# Altium schematic sheet USB_OTG.SchDoc
size A4; SheetNumber: 10; SheetTotal: 10
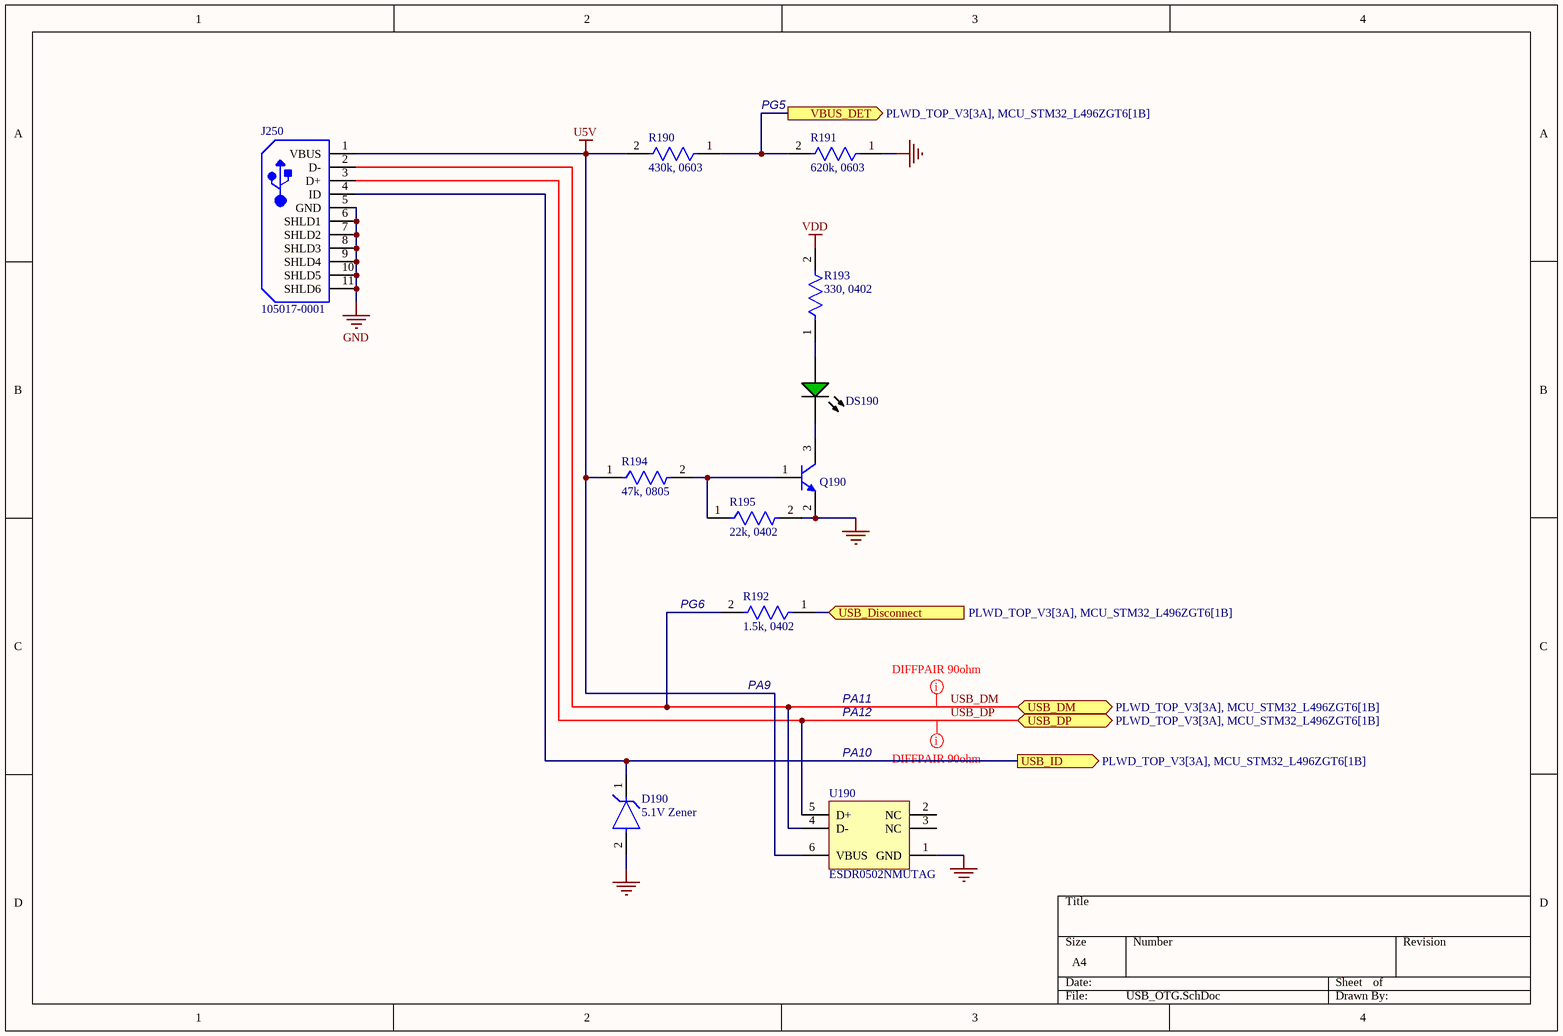
[diagram p0: USB_OTG.SchDoc]

## Parts
D190  5.1V Zener  [FP-SOD123-MFG]
DS190  LTST-C190GKT  [LTST-C190GKT_V]  (value not drawn)
J250  105017-0001  [USB-MICRO-B_V]
Q190  SBC817-40LT3G  [ONSC-SOT-23-3-318-08_V]  (value not drawn)
R190  430k, 0603  [FP-ESR03-IPC_C]
R191  620k, 0603  [FP-CRCW0603-e3-MFG]
R192  1.5k, 0402  [FP-RT0402-MFG]
R193  330, 0402  [FP-RG1005-MFG]
R194  47k, 0805  [FP-CRCW0805-HPe3-IPC_A]
R195  22k, 0402  [FP-RT0402-MFG]
U190  ESDR0502NMUTAG  [ONSC-UDFN-6-517AA-01_V]

## Ports
USB_Disconnect (in, see PLWD_TOP_V3[3A], MCU_STM32_L496ZGT6[1B]), USB_DM (bidir, see PLWD_TOP_V3[3A], MCU_STM32_L496ZGT6[1B]), USB_DP (bidir, see PLWD_TOP_V3[3A], MCU_STM32_L496ZGT6[1B]), USB_ID (out, see PLWD_TOP_V3[3A], MCU_STM32_L496ZGT6[1B]), VBUS_DET (out, see PLWD_TOP_V3[3A], MCU_STM32_L496ZGT6[1B])

## Nets
GND: D190.2(A) J250.5(GND) J250.6(SHLD1) J250.7(SHLD2) J250.8(SHLD3) J250.9(SHLD4) J250.10(SHLD5) J250.11(SHLD6) Q190.2(E) R191.1 R195.2 U190.1(GND)
U5V: J250.1(VBUS) R190.2 R194.1 U190.6(VBUS)
VDD: R193.2
USB_Disconnect: R192.1 ; port USB_Disconnect
USB_DM: J250.2(D-) R192.2 U190.4(D-) ; port USB_DM
USB_DP: J250.3(D+) U190.5(D+) ; port USB_DP
USB_ID: D190.1(C) J250.4(ID) ; port USB_ID
VBUS_DET: R190.1 R191.2 ; port VBUS_DET
NetDS190_1: DS190.1(A) R193.1
NetDS190_2: DS190.2(K) Q190.3(C)
NetQ190_1: Q190.1(B) R194.2 R195.1

Not connected (* = marked no-connect by the designer): U190 2(NC) 3(NC)

## Layout directives
mark named DIFFPAIR 90ohm: USB_DM, USB_DP

## Notes on the sheet
- PG5
- (near R192) PG6
- PA9
- PA12
- PA11
- PA10

## Library data of the parts
D190 = CMP-2000-05976-2: DIODE ZENER 5.1V 500MW SOD123; Manufacturer Part Number: BZT52C5V1-7-F; Manufacturer: Diodes Incorporated; Standoff Height: 0mm; Max Reverse Leakage Current: 2uA; Forward Current: 10mA; Power Dissipation: 370mW; Max Zener Voltage: 5.4V; Zener Impedance: 60Ω; Automotive Grade: NA; Max Junction Temp: +150°C; Device Class L3: Zener Diodes; ComponentLink2Description: Datasheet; Mouser Description: Zener Diodes 5.1V 500mW; Octopart: https://octopart.com/bzt52c5v1-7-f-diodes+inc.-326718; Package: SOD123; RoHS: TRUE; Nom Zener Voltage: 5.1V; Device Class L1: Discrete Semiconductors; Lead Free: Yes; Footprint Url: https://www.diodes.com/assets/Package-Files/SOD123.pdf; ComponentLink2URL: https://www.diodes.com/assets/Datasheets/ds18004.pdf; Digikey Description: DIODE ZENER 5.1V 500MW SOD123; Height: 1.45mm; Temperature Range Low: -65°C; Device Class L2: Diodes; Temperature: -65°C to +150°C; Automotive: No; Temperature Range High: +150°C; Category: Diode
DS190 = CMP-007-00022-2: LED Uni-Color Green, 100 mW, 30 mA, -55 to 85 degC, 2-Pin SMD, RoHS, Tape and Reel; Manufacturer: Lite-On; Power: 100mW; Forward Voltage: 2.1V; Viewing Angle: 130degrees; Forward Current: 20mA; Luminous Intensity: 6mcd; Lens Style: Clear; Manufacturer URL: http://www.us.liteon.com/; RoHS Compliant: True; Colour: Green; Package Description: 2-Pin Surface Mount Device, Body 1.6 x 0.8 mm; Datasheet URL: http://datasheet.octopart.com/LTST-C190GKT-Lite-On-datasheet-158530.pdf; Datasheet Version: Dec-06; Mounting Technology: SM; Case/Package: 0603; Package Reference: C190GKT; Packaging: TapeandReel; Min Operating Temperature: -55°C; Nominal Vf: 2.1V; Package Quantity: 3000; Illumination Colour: Green; Max Operating Temperature: 85°C; Pins: 2
J250 = CMP-2000-05827-1: Micro-USB B Receptacle, Right Angle, Bottom Mount, Surface Mount, with Solder Tabs, -30 to 85 degC, 5-Pin USB, RoHS, Tape and Reel; Manufacturer: Molex; Featured Product: Micro-USBConnectorsUSBConnectors; Other Names: WM1399DKR; Package Version: Rev. F, 12/2012; Number of Contacts: 5; Connector Type: USB-microB; Catalog Drawings: 1050170001; 3D Model: 105017-0001.stp; Mating Products: WM17145-ND-CABLEMICROUSBBTOSTDA1.0MWM17147-ND-CABLEMICROUSBBTOSTDA2.0MWM17146-ND-CABLEMICROUSBBTOSTDA1.5M; PCN Assembly/Origin: ResinSupplier21/Oct/2015; Voltage - Max: 30V; Online Catalog: Molex-MicroUSB; Manufacturer URL: http://www.molex.com/; Package Description: 5-Leads USB, Micro B, Body 7.5 x 5 mm, Pitch 0.65 mm; Datasheet URL: http://www.molex.com/elqNow/elqRedir.htm?ref=http://www.molex.com/webdocs/datasheets/pdf/en-us/1050170001_IO_CONNECTORS.pdf; Ingress Protection: -; Datasheet Version: 03/2016; Mounting Type: BoardCutout,SurfaceMount,RightAngle; Circuits: 5; Standard Package: 1; Package Reference: MICRO-B; Package URL: http://www.molex.com/pdm_docs/sd/1050170001_sd.pdf; Category: Connectors,Interconnects; Series: -; RoHS Information: 1050170001CertofCompliance; Features: Shielded,SolderRetention; Family: USB,DVI,HDMIConnectors; Specifications: -; Gender: Receptacle; Packaging: Digi-Reel®; Mounting Technology: SurfaceMount
Q190 = CMP-1048-00776-1: General Purpose Transistor, NPN Silicon, 3-Pin SOT-23, Pb-Free, Tape and Reel; Manufacturer: On Semiconductor; fT Min (MHz): 100; IC Continuous (A): 0.5; ComponentLink2URL: http://www.onsemi.com/pub_link/Collateral/BC817-16LT1-D.PDF; ComponentLink1Description: Manufacturer URL; Polarity: NPN; PackageDescription: 3-Pin Small Outline Transistor, Body 2.92 x 1.3 mm, Pitch 0.95 mm; ComponentLink2Description: Datasheet; PackageVersion: Rev. AP, 11/2009; Packing: Tape and Reel; RoHS: TRUE; ComponentLink3URL: http://www.onsemi.cn/pub_link/Collateral/318-08.PDF; PartNumber: SBC817-40LT3G; PackageReference: SOT-23-3-318-08; ComponentLink1URL: http://www.onsemi.com/; ComponentLink3Description: Package Specification; Mounting Technology: Surface Mount; DatasheetVersion: Rev. 12
R190 = CMP-08839-027977-1: 430kΩ ±5% 0.25W 0603 Anti-Surge Chip Resistor AEC-Q200; Temperature Coefficient: 200ppm/°C; Resistance: 430kR; Max Power Dissipation: 250mW; Length: 0.063inch; Case/Package: 0603; Number of Terminations: 2; Package Quantity: 5000; Series: ESR; Width: 0.031inch; Case Code (Imperial): 0603; Tolerance: 5%; Height: 0.022inch; Resistor Type: Thick Film; Packaging: Cut Tape; Min Operating Temperature: -55°C; Case Code (Metric): 1608; RoHS Compliant: Yes; Max Operating Temperature: 155°C; Features: Automotive AEC-Q200
R191 = CMP-2000-03512-2: RES Thick Film, 620kΩ, 5%, 0.1W, 200ppm/°C, 0603; Voltage Rating: 75V; Power Rating: 100mW; Resistance: 620kR; Tolerance: 5%; Military Standard: Not; Radiation Hardening: No; Lead Free: Lead Free; Contact Plating: Tin; Weight: 7.1E-05oz; Max Operating Temperature: 155°C; Case Code (Imperial): 0603; Voltage Rating (DC): 75V; Composition: Thick Film; Temperature Coefficient: 200ppm/°C; Height: 0.02inch; Min Operating Temperature: -55°C; Features: Automotive AEC-Q200; Width: 0.033inch; Max Power Dissipation: 100mW; Package Quantity: 1; Depth: 0.85mm; Length: 1.55mm; Packaging: Tape and Reel; Number of Terminations: 2; Case Code (Metric): 1608; Case/Package: 0603
R192 = CMP-03412-012409-1: RT0402DRE071K5L     RES SMD 1.5K OHM 0.5% 1/16W 0402; Manufacturer: Yageo; Power Rating: 0.063W; Temperature Coefficient: 50 ppm/°C; Resistance: 1.5KΩ; Voltage Rating: 50V; Value: 1.5KΩ; Tolerance: 0.005; Automotive: No; Composition: Thin Film; Device Class L2: Resistors; Footprint Url: http://www.yageo.com/exep/pages/download/literatures/PYu-R_Mount_10.pdf; Category: Res; RoHS: TRUE; Digikey Description: RES SMD 1.5K OHM 0.5% 1/16W 0402; Temperature Range Low: -55°C; Octopart: https://octopart.com/rt0402dre071k5l-yageo-1450177; Temperature Range High: +155°C; Device Class L3: Chip SMD Resistors; Temperature: -55°C to +155°C; Manufacturer Part Number: RT0402DRE071K5L; Ipc Land Pattern Name: RESC10050X30; Lead Free: Yes; Device Class L1: Passive Components; Series: RT; Height: 0.35mm; ComponentLink2Description: Datasheet; ComponentLink2URL: http://www.yageo.com/documents/recent/PYu-RT_1-to-0.01_RoHS_L_9.pdf; Package: RT0402
R193 = CMP-28537-007483-1: RG1005P-331-B-T5 / Automotive Metal Thin Film Chip Resistor, 0402, 330Ω, 0.1%, 25ppm/°C, 0.0625W, 75V; Power Rating: 63mW; Voltage Rating (DC): 25V; Resistance: 330R; Lead Free: Lead Free; Case Code (Metric): 1005; Width: 0.02inch; Tolerance: 0.1%; Max Power Dissipation: 63mW; Number of Terminations: 2; Resistor Type: Thin Film; Min Operating Temperature: -55°C; Package Quantity: 1; Resistance Tolerance: 0.1%; Case/Package: 0402; Voltage Rating: 75V; Length: 0.039inch; Height: 0.016inch; Max Operating Temperature: 155°C; Number of Pins: 2; Features: Automotive AEC-Q200; Series: RG; Weight: 2.3E-05oz; Termination: SMD/SMT; Case Code (Imperial): 0402; RoHS Compliant: Yes; Temperature Coefficient: 25ppm/°C; Packaging: Tape and Reel
R194 = CMP-02407-008731-1: RES Thick Film, 47kΩ, 1%, 0.5W, 100ppm/°C, 0805; Resistance: 47kR; Voltage Rating (DC): 150V; Max Power Dissipation: 333mW; Power Rating: 330mW; Case Code (Metric): 2012; Width: 1.2mm; Packaging: Cut Tape; Temperature Coefficient: 100ppm/°C; Number of Terminations: 2; Tolerance: 1%; Voltage Rating: 150V; Length: 2mm; Termination: SMD/SMT; Contact Plating: Tin; Lead Free: Lead Free; Package Quantity: 10; Mount: Surface Mount; Min Operating Temperature: -55°C; Composition: Thick Film; Case/Package: 0805; Max Operating Temperature: 155°C; Features: Automotive AEC-Q200; Depth: 1.25mm; Height: 0.024inch; Case Code (Imperial): 0805; Weight: 0.000194oz
R195 = CMP-2002-02617-2: RES SMD 22K OHM 0.1% 1/16W 0402; Manufacturer: Yageo; Manufacturer Part Number: RT0402BRD0722KL; Value: 22KΩ; Power Rating: 0.063W; Voltage Rating: 50V; Tolerance: 0.001; Temperature Coefficient: 25 ppm/°C; Package: RT0402; RoHS: TRUE; ComponentLink2Description: Datasheet; Octopart: https://octopart.com/rt0402brd0722kl-yageo-1219504; ComponentLink2URL: http://www.yageo.com/documents/recent/PYu-RT_1-to-0.01_RoHS_L_9.pdf; Composition: Thin Film; Temperature: -55°C to +155°C; Lead Free: Yes; Ipc Land Pattern Name: RESC10050X30; Temperature Range High: +155°C; Height: 0.35mm; Resistance: 22KΩ; Device Class L2: Resistors; Temperature Range Low: -55°C; Device Class L1: Passive Components; Digikey Description: RES SMD 22K OHM 0.1% 1/16W 0402; Automotive: No; Series: RT; Footprint Url: http://www.yageo.com/exep/pages/download/literatures/PYu-R_Mount_10.pdf; Category: Res; Device Class L3: Chip SMD Resistors; Mouser Description: Res Thin Film 0402 22K Ohm 0.1% 1/16W ±25ppm/°C Molded SMD SMD Paper T/R
U190 = CMP-1063-00250-1: Ultra Low Capacitance ESD Protection Array for High Speed Data Line Protection, 6-Pin UDFN, Pb-Free, Tape and Reel; Manufacturer: On Semiconductor; C Max (pF): 0.6; PPK Max (W): 100; V(BR) Min (V): 6; IR Max (uA): 1; Number of Lines: 4; VRWM Max (V): 5.5; Direction: Unidirectional; ComponentLink2URL: http://www.onsemi.cn/pub_link/Collateral/ESDR0502N-D.PDF; PackageDescription: 6-Pin Small Outline No-Lead, Body 1.2 x 1 mm, Pitch 0.4 mm; DatasheetVersion: Rev. 4; Packing: Tape and Reel; ComponentLink3URL: http://www.onsemi.com/pub_link/Collateral/517AA.PDF; PackageReference: UDFN-6-517AA-01; ComponentLink1Description: Manufacturer URL; ComponentLink2Description: Datasheet; ComponentLink3Description: Package Specification; PackageVersion: Rev. D, 09/2010; ComponentLink1URL: http://www.onsemi.com/; PartNumber: ESDR0502NMUTAG; RoHS: Pb-Free; Mounting Technology: Surface Mount